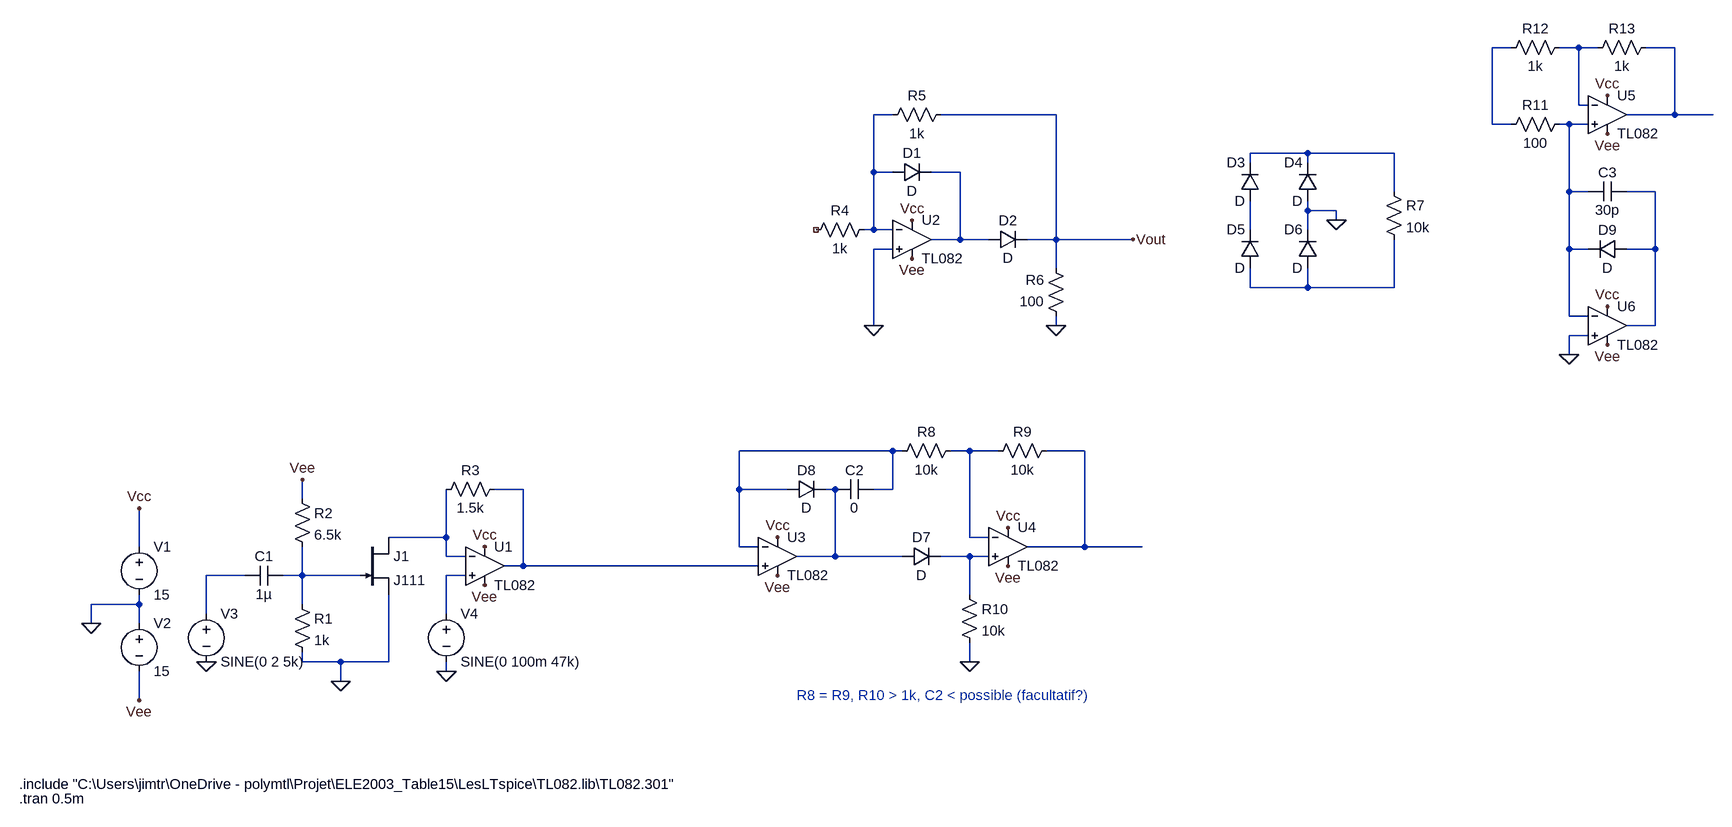
[diagram p0: schematic Mon_modulateur2.asc]
Mon_modulateur2.asc, the LTspice schematic file:
Version 4.1
SHEET 1 4180 680
WIRE 3104 -960 3072 -960
WIRE 3216 -960 3184 -960
WIRE 3248 -960 3216 -960
WIRE 3376 -960 3328 -960
WIRE 3216 -864 3216 -960
WIRE 3232 -864 3216 -864
WIRE 1648 -848 1616 -848
WIRE 1920 -848 1728 -848
WIRE 3376 -848 3376 -960
WIRE 3376 -848 3296 -848
WIRE 3440 -848 3376 -848
WIRE 3072 -832 3072 -960
WIRE 3104 -832 3072 -832
WIRE 3200 -832 3184 -832
WIRE 3232 -832 3200 -832
WIRE 2496 -784 2400 -784
WIRE 2640 -784 2496 -784
WIRE 2400 -768 2400 -784
WIRE 2496 -768 2496 -784
WIRE 1616 -752 1616 -848
WIRE 1648 -752 1616 -752
WIRE 1760 -752 1712 -752
WIRE 2640 -720 2640 -784
WIRE 3200 -720 3200 -832
WIRE 3232 -720 3200 -720
WIRE 3344 -720 3296 -720
WIRE 2496 -688 2496 -704
WIRE 2544 -688 2496 -688
WIRE 2544 -672 2544 -688
WIRE 1616 -656 1616 -752
WIRE 1616 -656 1600 -656
WIRE 1648 -656 1616 -656
WIRE 2400 -656 2400 -704
WIRE 2496 -656 2496 -688
WIRE 1760 -640 1760 -752
WIRE 1760 -640 1712 -640
WIRE 1808 -640 1760 -640
WIRE 1920 -640 1920 -848
WIRE 1920 -640 1872 -640
WIRE 2048 -640 1920 -640
WIRE 1648 -624 1616 -624
WIRE 3200 -624 3200 -720
WIRE 3232 -624 3200 -624
WIRE 3344 -624 3344 -720
WIRE 3344 -624 3296 -624
WIRE 1920 -592 1920 -640
WIRE 2400 -560 2400 -592
WIRE 2496 -560 2496 -592
WIRE 2496 -560 2400 -560
WIRE 2640 -560 2640 -640
WIRE 2640 -560 2496 -560
WIRE 3200 -512 3200 -624
WIRE 3232 -512 3200 -512
WIRE 1616 -496 1616 -624
WIRE 1920 -496 1920 -512
WIRE 3344 -496 3344 -624
WIRE 3344 -496 3296 -496
WIRE 3232 -480 3200 -480
WIRE 3200 -448 3200 -480
WIRE 1648 -144 1392 -144
WIRE 1664 -144 1648 -144
WIRE 1776 -144 1744 -144
WIRE 1824 -144 1776 -144
WIRE 1968 -144 1904 -144
WIRE 992 -80 944 -80
WIRE 1392 -80 1392 -144
WIRE 1472 -80 1392 -80
WIRE 1552 -80 1536 -80
WIRE 1648 -80 1648 -144
WIRE 1648 -80 1616 -80
WIRE 624 -64 624 -96
WIRE 864 0 864 -80
WIRE 864 0 768 0
WIRE 1776 0 1776 -144
WIRE 1808 0 1776 0
WIRE 352 16 352 -48
WIRE 1392 16 1392 -80
WIRE 1424 16 1392 16
WIRE 1968 16 1968 -144
WIRE 1968 16 1872 16
WIRE 2064 16 1968 16
WIRE 864 32 864 0
WIRE 896 32 864 32
WIRE 1552 32 1552 -80
WIRE 1552 32 1488 32
WIRE 1664 32 1552 32
WIRE 1776 32 1728 32
WIRE 1808 32 1776 32
WIRE 992 48 992 -80
WIRE 992 48 960 48
WIRE 1424 48 992 48
WIRE 528 64 464 64
WIRE 624 64 624 16
WIRE 624 64 592 64
WIRE 720 64 624 64
WIRE 896 64 864 64
WIRE 1776 96 1776 32
WIRE 352 112 352 96
WIRE 352 112 272 112
WIRE 624 112 624 64
WIRE 464 128 464 64
WIRE 864 128 864 64
WIRE 272 144 272 112
WIRE 352 144 352 112
WIRE 624 208 624 192
WIRE 688 208 624 208
WIRE 768 208 768 96
WIRE 768 208 688 208
WIRE 1776 208 1776 176
WIRE 864 224 864 208
WIRE 688 240 688 208
WIRE 352 272 352 224
FLAG 272 144 0
FLAG 352 272 Vee
FLAG 352 -48 Vcc
FLAG 464 208 0
FLAG 688 240 0
FLAG 624 -96 Vee
FLAG 864 224 0
FLAG 928 80 Vee
FLAG 928 16 Vcc
FLAG 1920 -496 0
FLAG 1680 -608 Vee
FLAG 1680 -672 Vcc
FLAG 2048 -640 Vout
FLAG 1616 -496 0
FLAG 2544 -672 0
FLAG 1456 64 Vee
FLAG 1456 0 Vcc
FLAG 1840 48 Vee
FLAG 1840 -16 Vcc
FLAG 1776 208 0
FLAG 3264 -816 Vee
FLAG 3264 -880 Vcc
FLAG 3264 -464 Vee
FLAG 3264 -528 Vcc
FLAG 3200 -448 0
SYMBOL voltage 352 0 R0
WINDOW 123 0 0 Left 0
WINDOW 39 0 0 Left 0
SYMATTR InstName V1
SYMATTR Value 15
SYMBOL voltage 352 128 R0
WINDOW 123 0 0 Left 0
WINDOW 39 0 0 Left 0
SYMATTR InstName V2
SYMATTR Value 15
SYMBOL voltage 464 112 R0
WINDOW 123 0 0 Left 0
WINDOW 39 0 0 Left 0
SYMATTR InstName V3
SYMATTR Value SINE(0 2 5k)
SYMBOL cap 592 48 R90
WINDOW 0 0 32 VBottom 2
WINDOW 3 32 32 VTop 2
SYMATTR InstName C1
SYMATTR Value 1µ
SYMBOL res 608 96 R0
SYMATTR InstName R1
SYMATTR Value 1k
SYMBOL res 608 -80 R0
SYMATTR InstName R2
SYMATTR Value 6.5k
SYMBOL voltage 864 112 R0
WINDOW 123 0 0 Left 0
WINDOW 39 0 0 Left 0
SYMATTR InstName V4
SYMATTR Value SINE(0 100m 47k)
SYMBOL OpAmps\\opamp2 928 -16 R0
SYMATTR InstName U1
SYMATTR Value TL082
SYMBOL res 960 -96 R90
WINDOW 0 0 56 VBottom 2
WINDOW 3 32 56 VTop 2
SYMATTR InstName R3
SYMATTR Value 1.5k
SYMBOL njf 720 0 R0
SYMATTR InstName J1
SYMATTR Value J111
SYMBOL OpAmps\\opamp2 1680 -704 R0
SYMATTR InstName U2
SYMATTR Value TL082
SYMBOL res 1616 -672 R90
WINDOW 0 0 56 VBottom 2
WINDOW 3 32 56 VTop 2
SYMATTR InstName R4
SYMATTR Value 1k
SYMBOL diode 1648 -736 R270
WINDOW 0 32 32 VTop 2
WINDOW 3 0 32 VBottom 2
SYMATTR InstName D1
SYMBOL diode 1808 -624 R270
WINDOW 0 32 32 VTop 2
WINDOW 3 0 32 VBottom 2
SYMATTR InstName D2
SYMBOL res 1744 -864 R90
WINDOW 0 0 56 VBottom 2
WINDOW 3 32 56 VTop 2
SYMATTR InstName R5
SYMATTR Value 1k
SYMBOL res 1936 -496 R180
WINDOW 0 36 76 Left 2
WINDOW 3 36 40 Left 2
SYMATTR InstName R6
SYMATTR Value 100
SYMBOL diode 2416 -704 R180
WINDOW 0 24 64 Left 2
WINDOW 3 24 0 Left 2
SYMATTR InstName D3
SYMBOL diode 2512 -704 R180
WINDOW 0 24 64 Left 2
WINDOW 3 24 0 Left 2
SYMATTR InstName D4
SYMBOL diode 2416 -592 R180
WINDOW 0 24 64 Left 2
WINDOW 3 24 0 Left 2
SYMATTR InstName D5
SYMBOL diode 2512 -592 R180
WINDOW 0 24 64 Left 2
WINDOW 3 24 0 Left 2
SYMATTR InstName D6
SYMBOL res 2624 -736 R0
SYMATTR InstName R7
SYMATTR Value 10k
SYMBOL OpAmps\\opamp2 1456 -32 R0
SYMATTR InstName U3
SYMATTR Value TL082
SYMBOL OpAmps\\opamp2 1840 -48 R0
SYMATTR InstName U4
SYMATTR Value TL082
SYMBOL res 1760 -160 R90
WINDOW 0 0 56 VBottom 2
WINDOW 3 32 56 VTop 2
SYMATTR InstName R8
SYMATTR Value 10k
SYMBOL res 1920 -160 R90
WINDOW 0 0 56 VBottom 2
WINDOW 3 32 56 VTop 2
SYMATTR InstName R9
SYMATTR Value 10k
SYMBOL diode 1664 48 R270
WINDOW 0 32 32 VTop 2
WINDOW 3 0 32 VBottom 2
SYMATTR InstName D7
SYMBOL res 1760 80 R0
SYMATTR InstName R10
SYMATTR Value 10k
SYMBOL cap 1616 -96 R90
WINDOW 0 0 32 VBottom 2
WINDOW 3 32 32 VTop 2
SYMATTR InstName C2
SYMATTR Value 0
SYMBOL diode 1472 -64 R270
WINDOW 0 32 32 VTop 2
WINDOW 3 0 32 VBottom 2
SYMATTR InstName D8
SYMBOL OpAmps\\opamp2 3264 -912 R0
SYMATTR InstName U5
SYMATTR Value TL082
SYMBOL OpAmps\\opamp2 3264 -560 R0
SYMATTR InstName U6
SYMATTR Value TL082
SYMBOL res 3200 -848 R90
WINDOW 0 0 56 VBottom 2
WINDOW 3 32 56 VTop 2
SYMATTR InstName R11
SYMATTR Value 100
SYMBOL res 3200 -976 R90
WINDOW 0 0 56 VBottom 2
WINDOW 3 32 56 VTop 2
SYMATTR InstName R12
SYMATTR Value 1k
SYMBOL res 3344 -976 R90
WINDOW 0 0 56 VBottom 2
WINDOW 3 32 56 VTop 2
SYMATTR InstName R13
SYMATTR Value 1k
SYMBOL cap 3296 -736 R90
WINDOW 0 0 32 VBottom 2
WINDOW 3 32 32 VTop 2
SYMATTR InstName C3
SYMATTR Value 30p
SYMBOL diode 3296 -640 R90
WINDOW 0 0 32 VBottom 2
WINDOW 3 32 32 VTop 2
SYMATTR InstName D9
TEXT 152 504 Left 2 !.include "C:\\Users\\jimtr\\OneDrive - polymtl\\Projet\\ELE2003_Table15\\LesLTspice\\TL082.lib\\TL082.301"
TEXT 152 528 Left 2 !.tran 0.5m
TEXT 1488 264 Left 2 ;R8 = R9, R10 > 1k, C2 < possible (facultatif?)

The netlist it stands for:
* Mon_modulateur2.asc
V1 Vcc 0 15
V2 0 Vee 15
V3 N018 0 SINE(0 2 5k)
C1 N019 N018 1µ
R1 N019 0 1k
R2 Vee N019 6.5k
V4 N020 0 SINE(0 100m 47k)
X§U1 N020 N016 Vcc Vee N014 TL082  ; pins In+ In- V+ V- OUT
R3 N014 N016 1.5k
J1 N016 N019 0 J111
X§U2 0 N004 Vcc Vee N007 TL082  ; pins In+ In- V+ V- OUT
R4 N004 NC_01 1k
D1 N004 N007 D
D2 N007 Vout D
R5 Vout N004 1k
R6 0 Vout 100
D3 N009 N006 D
D4 0 N006 D
D5 N010 N009 D
D6 N010 0 D
R7 N006 N010 10k
X§U3 N014 N011 Vcc Vee N015 TL082  ; pins In+ In- V+ V- OUT
X§U4 N017 N012 Vcc Vee N013 TL082  ; pins In+ In- V+ V- OUT
R8 N012 N011 10k
R9 N013 N012 10k
D7 N015 N017 D
R10 N017 0 10k
C2 N011 N015 0
D8 N011 N015 D
X§U5 N005 N002 Vcc Vee N003 TL082  ; pins In+ In- V+ V- OUT
X§U6 0 N005 Vcc Vee N008 TL082  ; pins In+ In- V+ V- OUT
R11 N005 N001 100
R12 N002 N001 1k
R13 N003 N002 1k
C3 N008 N005 30p
D9 N008 N005 D
.model D D
.lib standard.dio
.model NJF NJF
.model PJF PJF
.lib standard.jft
.include "C:\Users\jimtr\OneDrive - polymtl\Projet\ELE2003_Table15\LesLTspice\TL082.lib\TL082.301"
.tran 0.5m
* R8 = R9, R10 > 1k, C2 < possible (facultatif?)
.backanno
.end